# Altium schematic sheet sensors.SchDoc: SCHEMATIC
size B; Organization: Aries Industries, Inc.; Address1: 550 Elizabeth Street; Address2: Waukesha, WI, 53186; Address3: PH:  262-896-7205; Address4: FAX: 262-896-7099; DocumentNumber: 840XXX; Revision: A; SheetNumber: 1; SheetTotal: x
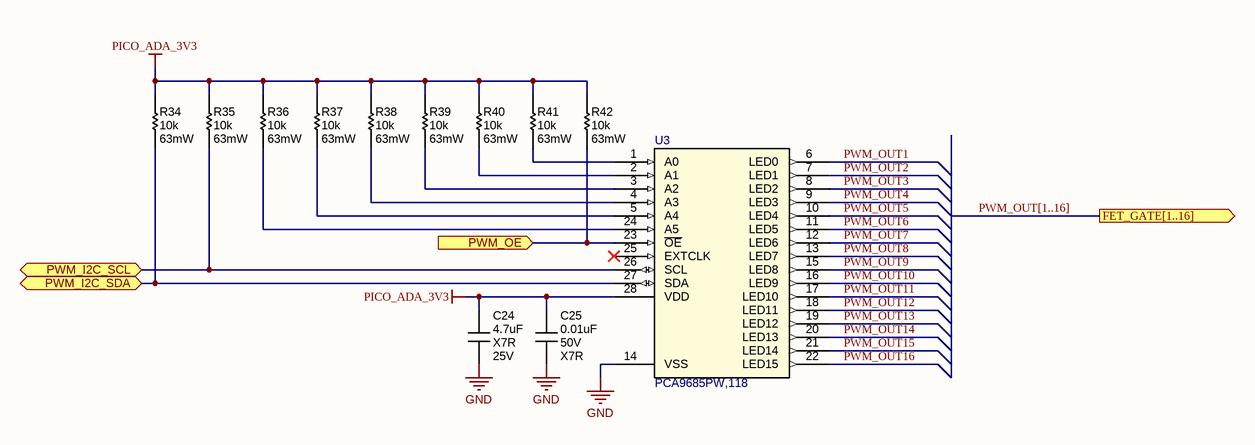
[diagram p0: sensors.SchDoc]

## Parts
C24  4.7uF  Temp Coeff: X7R  Voltage Rating: 25V  [CAPC2012X14N]
C25  0.01uF  Voltage Rating: 50V  Temp Coeff: X7R  [CAPC1005X06N]
R34  10k  Wattage: 63mW  [RESC1005X04N]
R35  10k  Wattage: 63mW  [RESC1005X04N]
R36  10k  Wattage: 63mW  [RESC1005X04N]
R37  10k  Wattage: 63mW  [RESC1005X04N]
R38  10k  Wattage: 63mW  [RESC1005X04N]
R39  10k  Wattage: 63mW  [RESC1005X04N]
R40  10k  Wattage: 63mW  [RESC1005X04N]
R41  10k  Wattage: 63mW  [RESC1005X04N]
R42  10k  Wattage: 63mW  [RESC1005X04N]
U3  PCA9685PW,118

## Ports
FET_GATE[1..16] (out), PWM_I2C_SCL (bidir), PWM_I2C_SDA (bidir), PWM_OE (in)

## Nets
GND: C24.2 C25.2 U3.14(VSS)
PICO_ADA_3V3: C24.1 C25.1 R34.2 R35.2 R36.2 R37.2 R38.2 R39.2 R40.2 R41.2 R42.2 U3.28(VDD)
PWM_I2C_SCL: R35.1 U3.26(SCL) ; port PWM_I2C_SCL
PWM_I2C_SDA: R34.1 U3.27(SDA) ; port PWM_I2C_SDA
PWM_OE: R42.1 U3.23(~{OE}) ; port PWM_OE
PWM_OUT1: U3.6(LED0)
PWM_OUT2: U3.7(LED1)
PWM_OUT3: U3.8(LED2)
PWM_OUT4: U3.9(LED3)
PWM_OUT5: U3.10(LED4)
PWM_OUT6: U3.11(LED5)
PWM_OUT7: U3.12(LED6)
PWM_OUT8: U3.13(LED7)
PWM_OUT9: U3.15(LED8)
PWM_OUT10: U3.16(LED9)
PWM_OUT11: U3.17(LED10)
PWM_OUT12: U3.18(LED11)
PWM_OUT13: U3.19(LED12)
PWM_OUT14: U3.20(LED13)
PWM_OUT15: U3.21(LED14)
PWM_OUT16: U3.22(LED15)
NetR36_1: R36.1 U3.24(A5)
NetR37_1: R37.1 U3.5(A4)
NetR38_1: R38.1 U3.4(A3)
NetR39_1: R39.1 U3.3(A2)
NetR40_1: R40.1 U3.2(A1)
NetR41_1: R41.1 U3.1(A0)

Not connected (* = marked no-connect by the designer): U3 25(EXTCLK)*

## Buses and harness runs
bus PWM_OUT[1..16] = port FET_GATE[1..16]

## Notes on the sheet
- Title
- Size:
- Date:
- B
- Number:
- Time:
- Revision:
- Sheet
- of
- File:

## Library data of the parts
C24 = CMP-004-0011: CAP CER 4.7UF 25V X7R 0805; MFR: TDK Corporation; MFR3#: 0805B475K500NT; MFR#: C2012X7R1E475K125AE; MFR2#: CL21B475KAFNNNE; Temp Range: -55 / +125 C; Tolerance: 10%; Capacitor Type: Ceramic; MFR2: Samsung Electro-Mechanics; Case Code (Metric): 2012; REACH SVHC: Yes; ComponentLink1URL: https://search.murata.co.jp/Ceramy/image/img/A01X/G101/ENG/GRM32EC72A106KE05-01.pdf; MFR3: FengHua; Design Item ID: CN/4.7uF/25V/X7R/10%/0805; Value: 4.7uF; RoHS Compliant: Yes; ComponentLink1Description: Datasheet; Case Code (Imperial): 0805
C25 = CMP-004-0077: CAP CER SMD 0.01UF 50V X7R 0402; MFR3#: C0402C103K5RAC7867; MFR#: GCM155R71H103KA55D; MFR: Murata Electronics; MFR4#: CL05B103KB5NNNC; MFR2#: CC0402KRX7R9BB103; Tolerance: 10%; Populate: Yes; Temp Range: -55 / +125 C; Capacitor Type: Ceramic; Case Code (Imperial): 0402; Value: 0.01uF; MFR4: Samsung Electro-Mechanics; Design Item ID: CN/0.01UF/50V/X7R/10%/0402; Case Code (Metric): 1005; ComponentLink1URL: https://search.murata.co.jp/Ceramy/image/img/A01X/G101/ENG/GCM155R71H103KA55-01.pdf; MFR3: KEMET; MFR2: YAGEO; ComponentLink1Description: Datasheet; RoHS Compliant: Yes; Part Status: Production
R34-R42 = CMP-025-0026: RES SMD 10K OHM 0.5% 1/16W 0402; MFR2#: RNCF0402DTE10K0; MFR#: ERA-2AED103X; MFR: Panasonic Electronic Components; Temp Range: -55 / +155 C; Voltage Rating: 50V; Temperature Coefficient: 25ppm/°C; Quality: AEC-Q200; MFR2: Stackpole Electronics Inc; RoHS Compliant: Yes; ComponentLink1Description: Datasheet; REACH SVHC: Yes; Value: 10k; Case Code (Imperial): 0402; Case Code (Metric): 1005; Tolerance: 0.5%; Resistor Type: Thick Film; Design Item ID: R/10.0K/0.063W/0.5%/0402; ComponentLink1URL: https://industrial.panasonic.com/cdbs/www-data/pdf/RDM0000/AOA0000C307.pdf
U3 = CMP-017-0111: IC LED DRVR LIN PWM 25MA 28TSSOP; MFR: NXP; Populate: Yes; REACFH SVCH: Unaffected; Temp Range, Ambient: -40 / +125 C; Voltage Range: 2.3V - 5.5V DC; Temp Range, Junction: -40 / +150C; Value: PCA9685PW,118; MFR#: PCA9685PW,118; Case Package: TSSOP28; Design Item ID: IC/LDRV/PCA9685PW/TSSOP28; Part Status: Production; RoHS Comliant: Yes; Type: LED DRIVER; ComponentLink1Description: Datasheet; ComponentLink1URL: https://www.nxp.com/docs/en/data-sheet/PCA9685.pdf